# Altium project sharp.PrjPcb
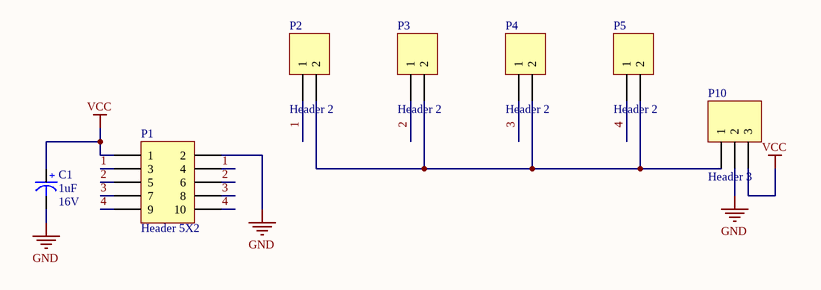
[diagram p0: sharp.SchDoc]
1 sheet, 7 parts. Net scope: global (net labels, ports and power ports of the same name join across sheets).
Board file: sharp.PcbDoc

## Sheet sharp.SchDoc
size A

### Parts
C1  Voltage: 16V  [cap 01]  (hidden comment: 1uF)
P1  Header 5X2  [HDR2X5]
P2  Header 2  [HDR1X2]
P3  Header 2  [HDR1X2]
P4  Header 2  [HDR1X2]
P5  Header 2  [HDR1X2]
P10  Header 3  [HDR1X3]

### Nets
GND: C1.2(-) P1.2 P10.2
VCC: C1.1(+) P1.1 P10.3
1: P1.3 P1.4 P2.1
2: P1.5 P1.6 P3.1
3: P1.7 P1.8 P4.1
4: P1.9 P1.10 P5.1
NetP2_2: P2.2 P3.2 P4.2 P5.2 P10.1

### Library data of the parts
C1 = Cap-Polar: Polar Capacitor; Designer: Saeid Jorablo; Organazation: ControTec; Adding Date: 1387/12/20; Value: 1uF
P1 = Header 5X2: Header, 5-Pin, Dual row; LatestRevisionDate: 17-Jul-2002; LatestRevisionNote: Re-released for DXP Platform.; Publisher: Altium Limited
P2-P5 = Header 2: Header, 2-Pin; LatestRevisionDate: 17-Jul-2002; LatestRevisionNote: Re-released for DXP Platform.; Publisher: Altium Limited
P10 = Header 3: Header, 3-Pin; LatestRevisionDate: 17-Jul-2002; LatestRevisionNote: Re-released for DXP Platform.; Publisher: Altium Limited